# Altium schematic sheet ATmegaMain.SchDoc
size A
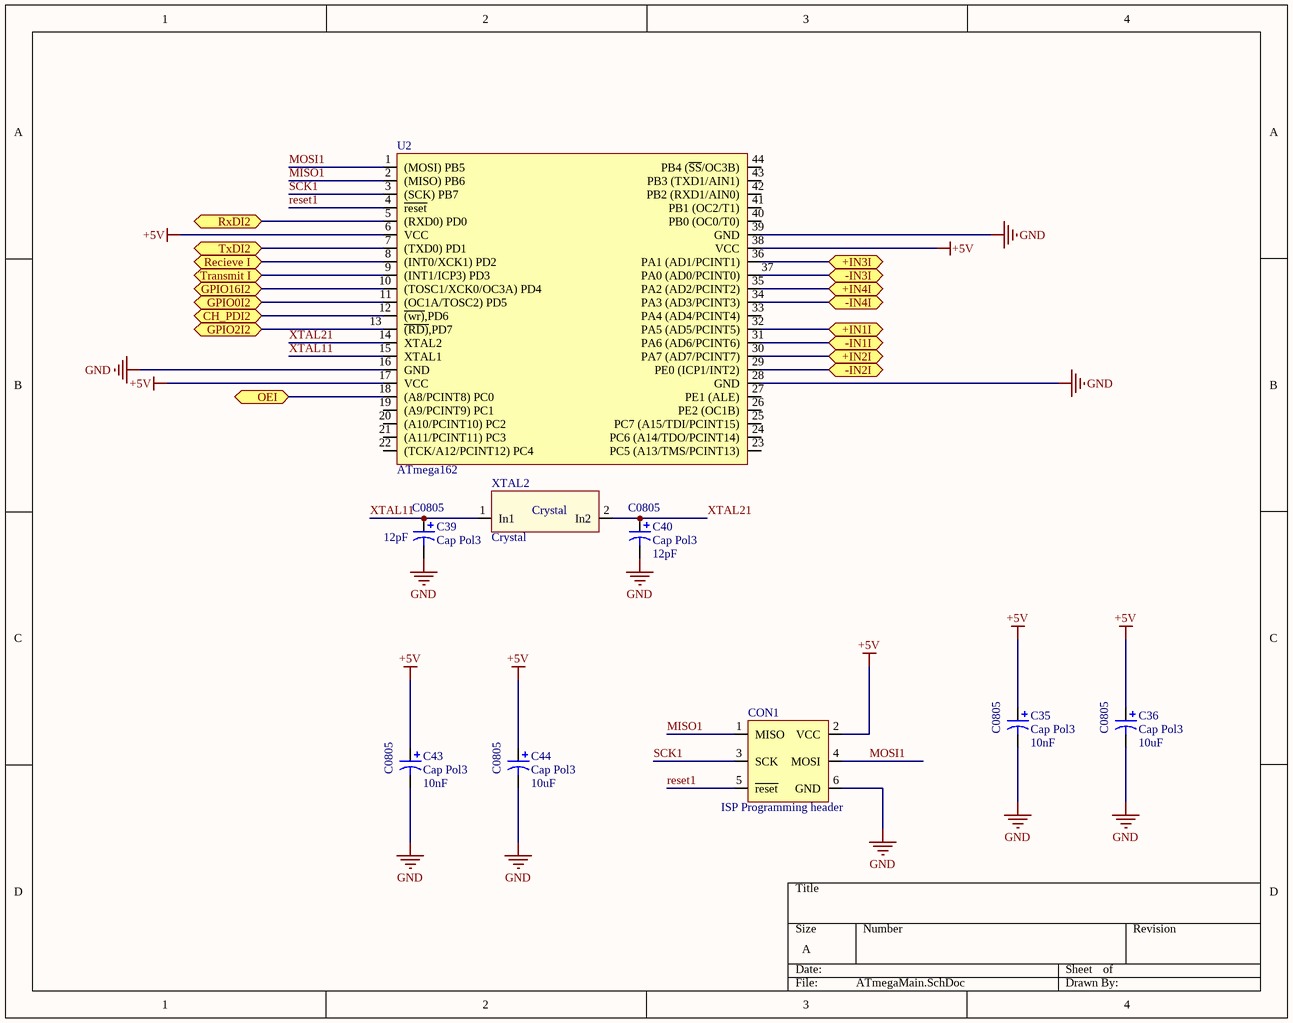
[diagram p0: ATmegaMain.SchDoc]

## Parts
C35  Cap Pol3  value 10nF  [C0805]
C36  Cap Pol3  value 10uF  [C0805]
C39  Cap Pol3  value 12pF  [C0805]
C40  Cap Pol3  value 12pF  [C0805]
C43  Cap Pol3  value 10nF  [C0805]
C44  Cap Pol3  value 10uF  [C0805]
CON1  ISP Programming header  [ISP programming header]
U2  ATmega162  [ATmga162]
XTAL2  Crystal  [Crystal]

## Ports
+IN1I, +IN2I, +IN3I, +IN4I, -IN1I, -IN2I, -IN3I, -IN4I, CH_PDI2, GPIO0I2, GPIO2I2, GPIO16I2, OEI, Recieve I, RxDI2, Transmit I, TxDI2

## Nets
+5V: C35.1 C36.1 C43.1 C44.1 CON1.2(VCC) U2.6(VCC) U2.17(VCC) U2.38(VCC)
GND: C35.2 C36.2 C39.2 C40.2 C43.2 C44.2 CON1.6(GND) U2.16(GND) U2.28(GND) U2.39(GND)
+IN1I: U2.32(PA5_(AD5/PCINT5)) ; port +IN1I
+IN2I: U2.30(PA7_(AD7/PCINT7)) ; port +IN2I
+IN3I: U2.36(PA1_(AD1/PCINT1)) ; port +IN3I
+IN4I: U2.35(PA2_(AD2/PCINT2)) ; port +IN4I
-IN1I: U2.31(PA6_(AD6/PCINT6)) ; port -IN1I
-IN2I: U2.29(PE0_(ICP1/INT2)) ; port -IN2I
-IN3I: U2.37(PA0_(AD0/PCINT0)) ; port -IN3I
-IN4I: U2.34(PA3_(AD3/PCINT3)) ; port -IN4I
CH_PDI2: U2.12(~{(wr}~{)},PD6) ; port CH_PDI2
GPIO0I2: U2.11((OC1A/TOSC2)_PD5) ; port GPIO0I2
GPIO2I2: U2.13(~{(RD)},PD7) ; port GPIO2I2
GPIO16I2: U2.10((TOSC1/XCK0/OC3A)_PD4) ; port GPIO16I2
MISO1: CON1.1(MISO) U2.2((MISO)_PB6)
MOSI1: CON1.4(MOSI) U2.1((MOSI)_PB5)
OEI: U2.18((A8/PCINT8)_PC0) ; port OEI
Recieve I: U2.8((INT0/XCK1)_PD2) ; port Recieve I
reset1: CON1.5(~{reset}) U2.4(~{reset})
RxDI2: U2.5((RXD0)_PD0) ; port RxDI2
SCK1: CON1.3(SCK) U2.3((SCK)_PB7)
Transmit I: U2.9((INT1/ICP3)_PD3) ; port Transmit I
TxDI2: U2.7((TXD0)_PD1) ; port TxDI2
XTAL11: C39.1 U2.15(XTAL1) XTAL2.1(In1)
XTAL21: C40.1 U2.14(XTAL2) XTAL2.2(In2)

Not connected (* = marked no-connect by the designer): U2 19((A9/PCINT9)_PC1) 20((A10/PCINT10)_PC2) 21((A11/PCINT11)_PC3) 22((TCK/A12/PCINT12)_PC4) 23(PC5_(A13/TMS/PCINT13)) 24(PC6_(A14/TDO/PCINT14)) 25(PC7_(A15/TDI/PCINT15)) 26(PE2_(OC1B)) 27(PE1_(ALE)) 33(PA4_(AD4/PCINT4)) 40(PB0_(OC0/T0)) 41(PB1_(OC2/T1)) 42(PB2_(RXD1/AIN0)) 43(PB3_(TXD1/AIN1)) 44(PB4_(~{SS}/OC3B))

## Library data of the parts
C35 C36 C39 C40 C43 C44 = Cap Pol3: Polarized Capacitor (Surface Mount); Published: 8-Jun-2000; LatestRevisionDate: 29-May-2009; LatestRevisionNote: IPC-7351 Footprint Added.; PackageReference: C0805; Publisher: Altium Limited; PackageDescription: Chip Capacitor